# EAGLE design demeter_v28-TSSOP (EAGLE 6.1)
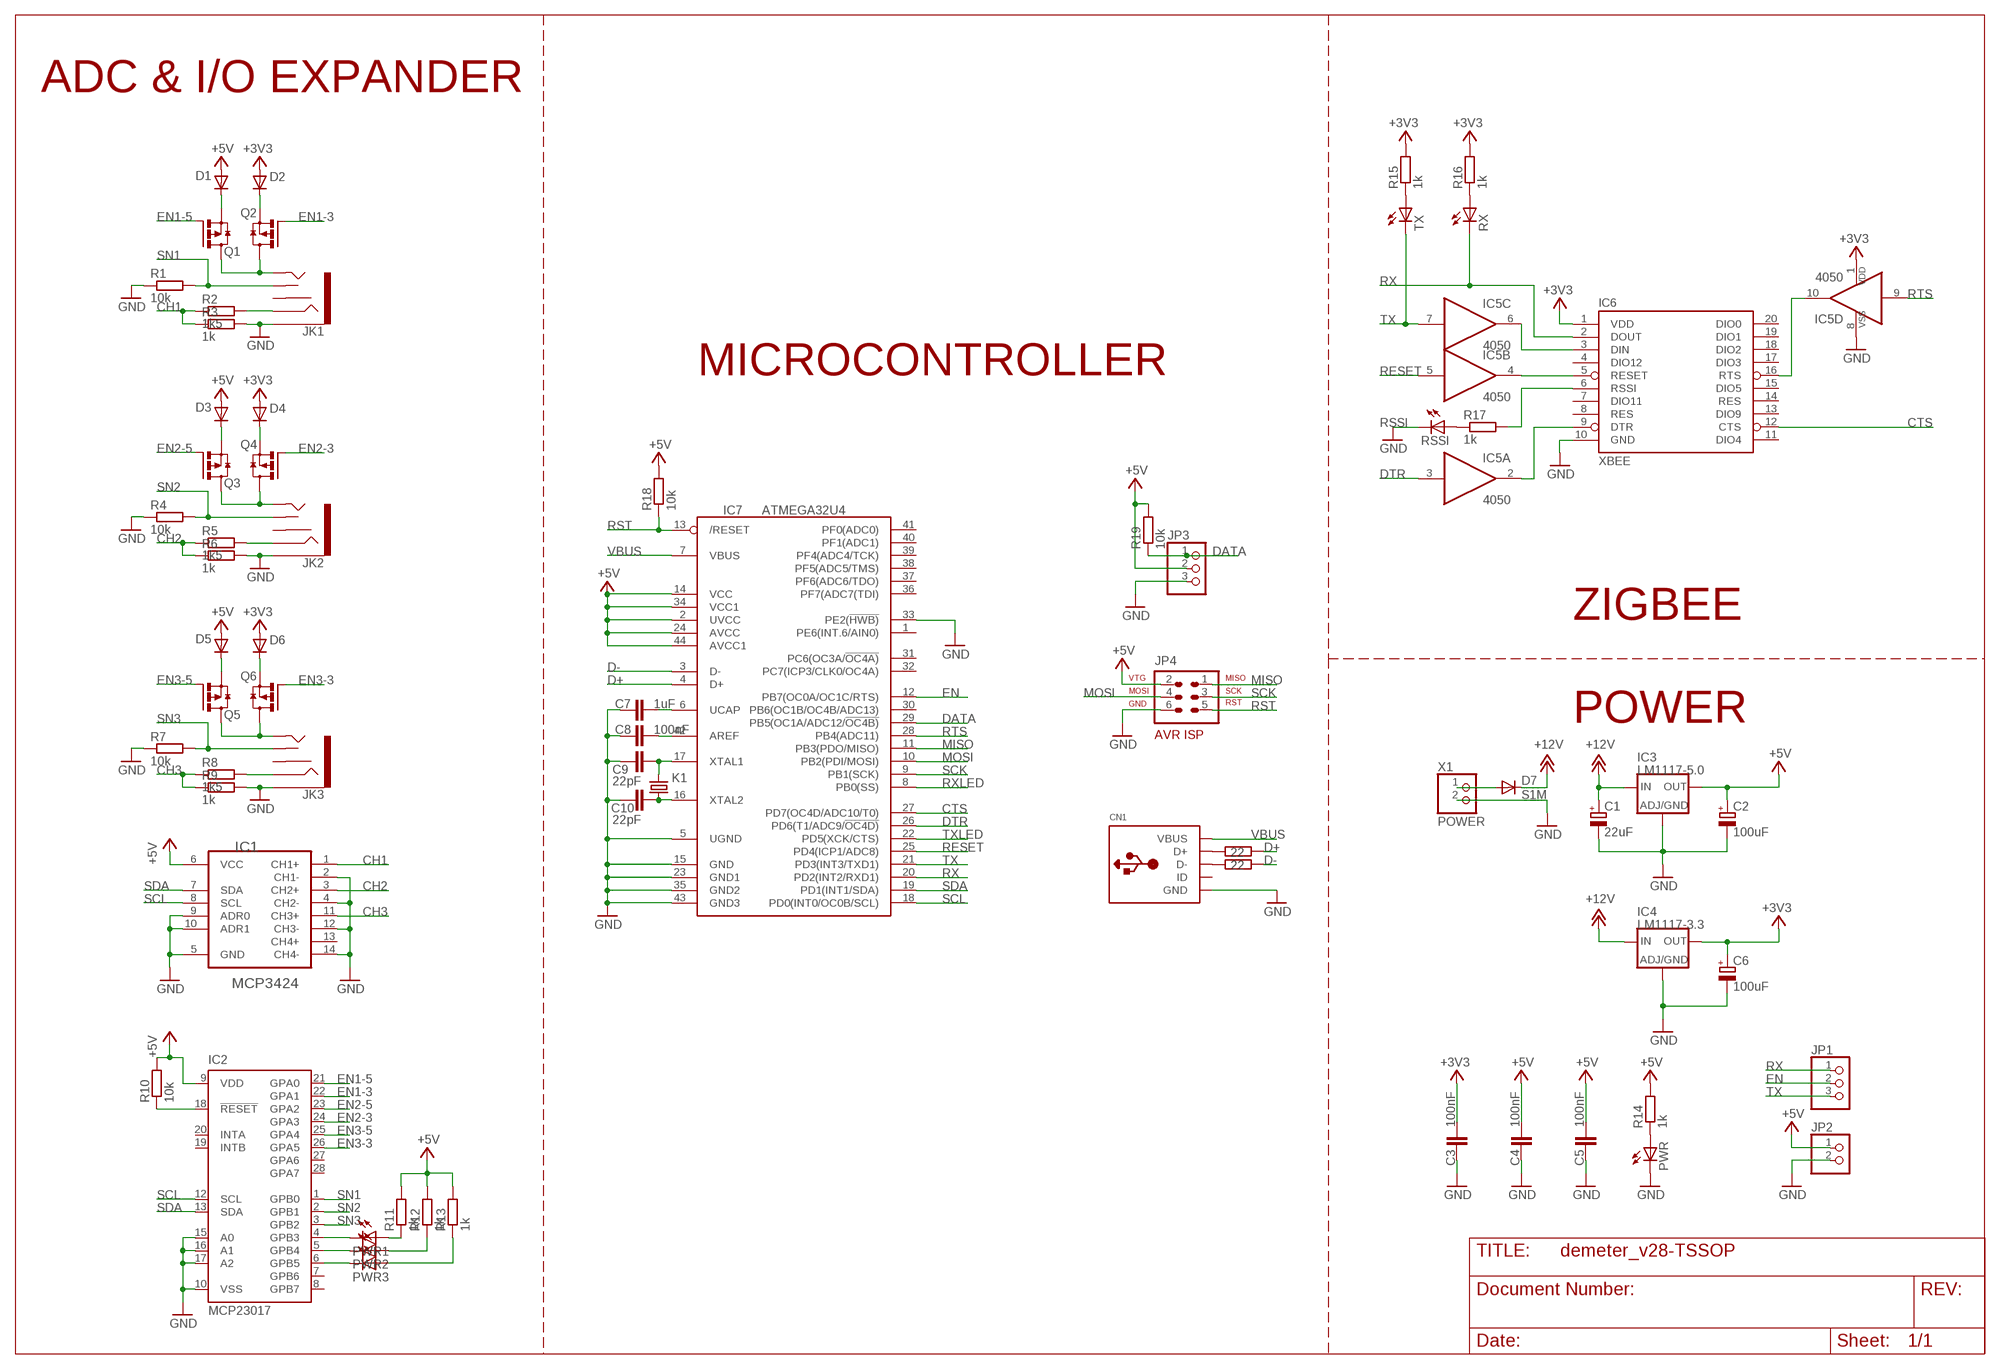
[diagram p0: schematic, sheet 1]

## Parts
C1  22uF  CPOL-EUPD  [PANASONIC_D]
C2  100uF  CPOL-EUPD  [PANASONIC_D]
C3  100nF  C-EUC0805K  [C0805K]
C4  100nF  C-EUC0805K  [C0805K]
C5  100nF  C-EUC0805K  [C0805K]
C6  100uF  CPOL-EUPD  [PANASONIC_D]
C7  1uF  C-EUC0805K  [C0805K]
C8  100nF  C-EUC0805K  [C0805K]
C9  22pF  C-EUC0805K  [C0805K]
C10  22pF  C-EUC0805K  [C0805K]
CN1  USBMINIB  [USB-MINIB]
D1  MBR0520  [SOD123]
D2  MBR0520  [SOD123]
D3  MBR0520  [SOD123]
D4  MBR0520  [SOD123]
D5  MBR0520  [SOD123]
D6  MBR0520  [SOD123]
D7  S1M  [DO-214AC]
IC1  MCP3424  MCP3424T  [TSSOP14]
IC2  MCP23017  MCP23017SO  [SO28W]
IC3  LM1117-5.0  LM1117DT  [DPACK]
IC4  LM1117-3.3  LM1117DT  [DPACK]
IC5  4050  4050D  [SO16]
IC6  XBEE  XBEE-1B1  [XBEE-1]
IC7  ATMEGA32U4  ATMEGA32U4-AU  [TQFP44]
JK1  AUDIO-JACK2PTH  [AUDIO-JACK]
JK2  AUDIO-JACK2PTH  [AUDIO-JACK]
JK3  AUDIO-JACK2PTH  [AUDIO-JACK]
JP1  PINHD-1X3180  [1X03]
JP2  PINHD-1X2  [1X02]
JP3  PINHD-1X3180  [1X03]
JP4  AVR-ISP  AVR-ISP-6  [AVR-ISP-6]
K1  CRYSTALHC49UP  [HC49UP]
PWR  LED0805  [CHIP-LED0805]
PWR1  LED0805  [CHIP-LED0805]
PWR2  LED0805  [CHIP-LED0805]
PWR3  LED0805  [CHIP-LED0805]
Q1  IRLML6402  [SOT23]
Q2  IRLML6402  [SOT23]
Q3  IRLML6402  [SOT23]
Q4  IRLML6402  [SOT23]
Q5  IRLML6402  [SOT23]
Q6  IRLML6402  [SOT23]
R1  10k  R-EU_R0805  [R0805]
R2  1k5  R-EU_R0805  [R0805]
R3  1k  R-EU_R0805  [R0805]
R4  10k  R-EU_R0805  [R0805]
R5  1k5  R-EU_R0805  [R0805]
R6  1k  R-EU_R0805  [R0805]
R7  10k  R-EU_R0805  [R0805]
R8  1k5  R-EU_R0805  [R0805]
R9  1k  R-EU_R0805  [R0805]
R10  10k  R-EU_R0805  [R0805]
R11  1k  R-EU_R0805  [R0805]
R12  1k  R-EU_R0805  [R0805]
R13  1k  R-EU_R0805  [R0805]
R14  1k  R-EU_R0805  [R0805]
R15  1k  R-EU_R0805  [R0805]
R16  1k  R-EU_R0805  [R0805]
R17  1k  R-EU_R0805  [R0805]
R18  10k  R-EU_R0805  [R0805]
R19  10k  R-EU_R0805  [R0805]
R20  22  R-EU_R0805  [R0805]
R21  22  R-EU_R0805  [R0805]
RSSI  LED0805  [CHIP-LED0805]
RX  LED0805  [CHIP-LED0805]
TX  LED0805  [CHIP-LED0805]
X1  POWER  W237-102  [W237-102]

## Nets
+3V3: C3.1 C6.+ D2.A D4.A D6.A IC4.4(OUT) IC5.1(P:VDD) IC6.1(VDD) R15.2 R16.2
+5V: C2.+ C4.1 C5.1 D1.A D3.A D5.A IC1.6(VCC) IC2.9(VDD) IC3.4(OUT) IC7.2(UVCC) IC7.14(VCC) IC7.24(AVCC) IC7.34(VCC1) IC7.44(AVCC1) JP2.1 JP3.2 JP4.2(VTG) R10.2 R11.2 R12.2 R13.2 R14.2 R18.2 R19.2
+12V: C1.+ D7.C IC3.3(IN) IC4.3(IN)
CH1: IC1.1(CH1+) R2.1 R3.1
CH2: IC1.3(CH2+) R5.1 R6.1
CH3: IC1.11(CH3+) R8.1 R9.1
CTS: IC6.12(CTS) IC7.27(PD7(OC4D/ADC10/T0))
D+: IC7.4(D+) R20.1
D-: IC7.3(D-) R21.1
DATA: IC7.29(PB5(OC1A/ADC12/!OC4B)) JP3.1 R19.1
DTR: IC5.3(A:I) IC7.26(PD6(T1/ADC9/!OC4D))
EN: IC7.12(PB7(OC0A/OC1C/RTS)) JP1.2
EN1-3: IC2.22(GPA1) Q2.1(G)
EN1-5: IC2.21(GPA0) Q1.1(G)
EN2-3: IC2.24(GPA3) Q4.1(G)
EN2-5: IC2.23(GPA2) Q3.1(G)
EN3-3: IC2.26(GPA5) Q6.1(G)
EN3-5: IC2.25(GPA4) Q5.1(G)
GND: C1.- C2.- C3.2 C4.2 C5.2 C6.- C7.2 C8.2 C9.2 C10.2 CN1.GND CN1.GND1(GND) CN1.GND2(GND) CN1.GND3(GND) CN1.GND4(GND) IC1.2(CH1-) IC1.4(CH2-) IC1.5(GND) IC1.9(ADR0) IC1.10(ADR1) IC1.12(CH3-) IC1.14(CH4-) IC2.10(VSS) IC2.15(A0) IC2.16(A1) IC2.17(A2) IC3.1(ADJ) IC4.1(ADJ) IC5.8(P:VSS) IC6.10(GND) IC7.5(UGND) IC7.15(GND) IC7.23(GND1) IC7.33(PE2(!HWB)) IC7.35(GND2) IC7.43(GND3) JK1.SLEEVE JK2.SLEEVE JK3.SLEEVE JP2.2 JP3.3 JP4.6(GND) PWR.C R1.1 R3.2 R4.1 R6.2 R7.1 R9.2 RSSI.C X1.2
MISO: IC7.11(PB3(PDO/MISO)) JP4.1(MISO)
MOSI: IC7.10(PB2(PDI/MOSI)) JP4.4(MOSI)
N$1: D7.A X1.1
N$2: PWR.A R14.1
N$3: IC5.6(C:O) IC6.3(DIN)
N$4: IC5.4(B:O) IC6.5(RESET)
N$5: PWR3.A R13.1
N$6: R17.1 RSSI.A
N$7: IC5.2(A:O) IC6.9(DTR)
N$8: IC5.10(D:O) IC6.16(RTS)
N$9: IC2.6(GPB5) PWR3.C
N$10: IC2.4(GPB3) PWR1.C
N$11: IC2.18(!RESET) R10.1
N$12: JK1.TIP Q1.3(D) Q2.3(D)
N$13: D1.C Q1.2(S)
N$14: D2.C Q2.2(S)
N$15: JK2.TIP Q3.3(D) Q4.3(D)
N$16: D3.C Q3.2(S)
N$17: D4.C Q4.2(S)
N$18: JK3.TIP Q5.3(D) Q6.3(D)
N$19: D5.C Q5.2(S)
N$20: D6.C Q6.2(S)
N$22: PWR2.A R12.1
N$23: PWR1.A R11.1
N$24: C7.1 IC7.6(UCAP)
N$25: C8.1 IC7.42(AREF)
N$26: C9.1 IC7.17(XTAL1) K1.2
N$27: C10.1 IC7.16(XTAL2) K1.1
N$28: CN1.D+ R20.2
N$29: CN1.D- R21.2
N$30: JK1.RING R2.2
N$32: JK2.RING R5.2
N$33: IC2.5(GPB4) PWR2.C
N$34: JK3.RING R8.2
N$36: R15.1 TX.A
N$37: R16.1 RX.A
RESET: IC5.5(B:I) IC7.25(PD4(ICP1/ADC8))
RSSI: IC6.6(RSSI) R17.2
RST: IC7.13(/RESET) JP4.5(RST) R18.1
RTS: IC5.9(D:I) IC7.28(PB4(ADC11))
RX: IC6.2(DOUT) IC7.20(PD2(INT2/RXD1)) JP1.1 RX.C
RXLED: IC7.8(PB0(SS))
SCK: IC7.9(PB1(SCK)) JP4.3(SCK)
SCL: IC1.8(SCL) IC2.12(SCL) IC7.18(PD0(INT0/OC0B/SCL))
SDA: IC1.7(SDA) IC2.13(SDA) IC7.19(PD1(INT1/SDA))
SN1: IC2.1(GPB0) JK1.TSH R1.2
SN2: IC2.2(GPB1) JK2.TSH R4.2
SN3: IC2.3(GPB2) JK3.TSH R7.2
TX: IC5.7(C:I) IC7.21(PD3(INT3/TXD1)) JP1.3 TX.C
TXLED: IC7.22(PD5(XCK/CTS))
VBUS: CN1.VBUS IC7.7(VBUS)
Unconnected: CN1.ID IC1.13(CH4+) IC2.7(GPB6) IC2.8(GPB7) IC2.19(INTB) IC2.20(INTA) IC2.27(GPA6) IC2.28(GPA7) IC5.11(E:I) IC5.12(E:O) IC5.14(F:I) IC5.15(F:O) IC6.4(DIO12) IC6.7(DIO11) IC6.8(RES) IC6.11(DIO4) IC6.13(DIO9) IC6.14(RES) IC6.15(DIO5) IC6.17(DIO3) IC6.18(DIO2) IC6.19(DIO1) IC6.20(DIO0) IC7.1(PE6(INT.6/AIN0)) IC7.30(PB6(OC1B/OC4B/ADC13)) IC7.31(PC6(OC3A/!OC4A)) IC7.32(PC7(ICP3/CLK0/OC4A)) IC7.36(PF7(ADC7(TDI)) IC7.37(PF6(ADC6/TDO)) IC7.38(PF5(ADC5/TMS)) IC7.39(PF4(ADC4/TCK)) IC7.40(PF1(ADC1)) IC7.41(PF0(ADC0)) JK1.RSH JK2.RSH JK3.RSH

## Notes on the sheet
- ADC & I/O EXPANDER
- MICROCONTROLLER
- ZIGBEE
- POWER

## Library data of the parts
C1 C2 C6 = mark_2:CPOL-EU: POLARIZED CAPACITOR, European symbol
C3-C5 C7-C10 = mark_2:C-EU: CAPACITOR, European symbol
CN1 = mark_2:USB: USB Connectors USBMINIB - Surface Mount Female Mini-B USB Connector 4UConnector: 06564 By microbuilder.eu Thru-hole RA Female Mini-B USB Connector 4UConnector: 18732 By ladyada.net
D1-D6 = mark_2:MBR0520: SCHOTTKY BARRIER RECTIFIER Source: http://onsemi.com .. MBR0520LT1-D.pdf
D7 = mark_2:S1M
IC1 = mark_2:MCP3424: Analog-to-Digital Converter
IC2 = mark_2:MCP23017: http://ww1.microchip.com/downloads/en/DeviceDoc/21952a.pdf Source: http://ww1.microchip.com/downloads/en/DeviceDoc/21952a.pdf; MF: MICROCHIP; MPN: MCP23017-E/SO; OC_FARNELL: 1332087; OC_NEWARK: 31K2958
IC3 IC4 = mark_2:LM1117: Low drop fixed and adjustable positive voltage regulators 1 A Source: http://www.st.com/stonline/products/literature/ds/7194/ld1117axx.pdf
IC5 = mark_2:4050: Hex non-inverting BUFFER
IC6 = mark_2:XBEE-1
IC7 = mark_2:ATMEGA32U4: http://www.ladyada.net/library/eagle
JK1-JK3 = mark_2:AUDIO-JACK2
JP1 JP3 = mark_2:PINHD-1X3: PIN HEADER
JP2 = mark_2:PINHD-1X2: PIN HEADER
JP4 = mark_2:AVR-ISP-6: AVR ISP-6 Serial Programming Header
K1 = mark_2:CRYSTAL: CRYSTAL
PWR PWR1-PWR3 RSSI RX TX = mark_2:LED
Q1-Q6 = mark_2:IRLML6402: Single P-Channe MOSFET
R1-R21 = mark_2:R-EU_: RESISTOR, European symbol
X1 = mark_2:W237-102: WAGO SCREW CLAMP

## Board
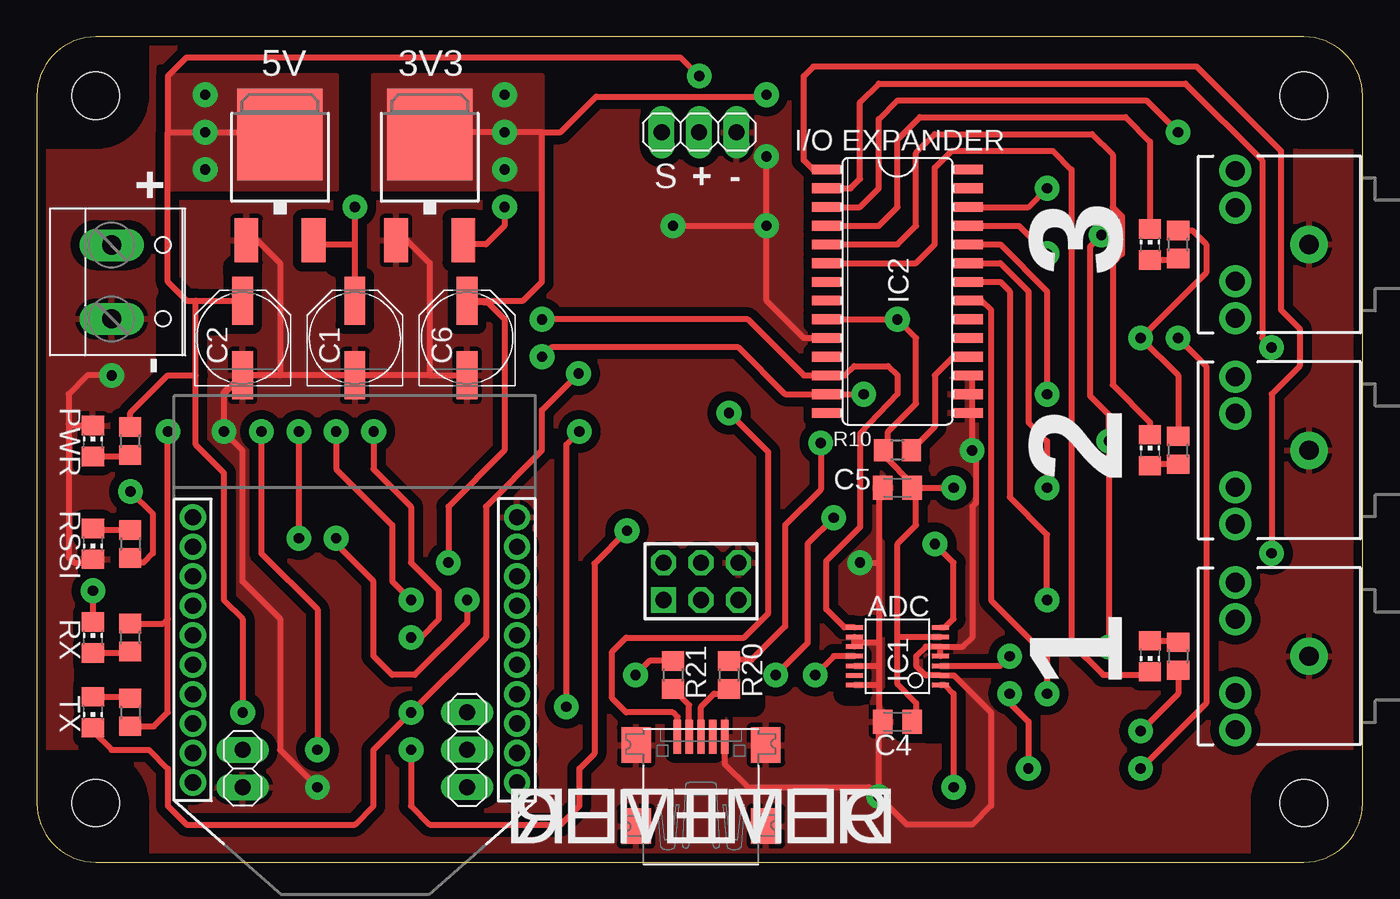
[diagram p1: board, top side]
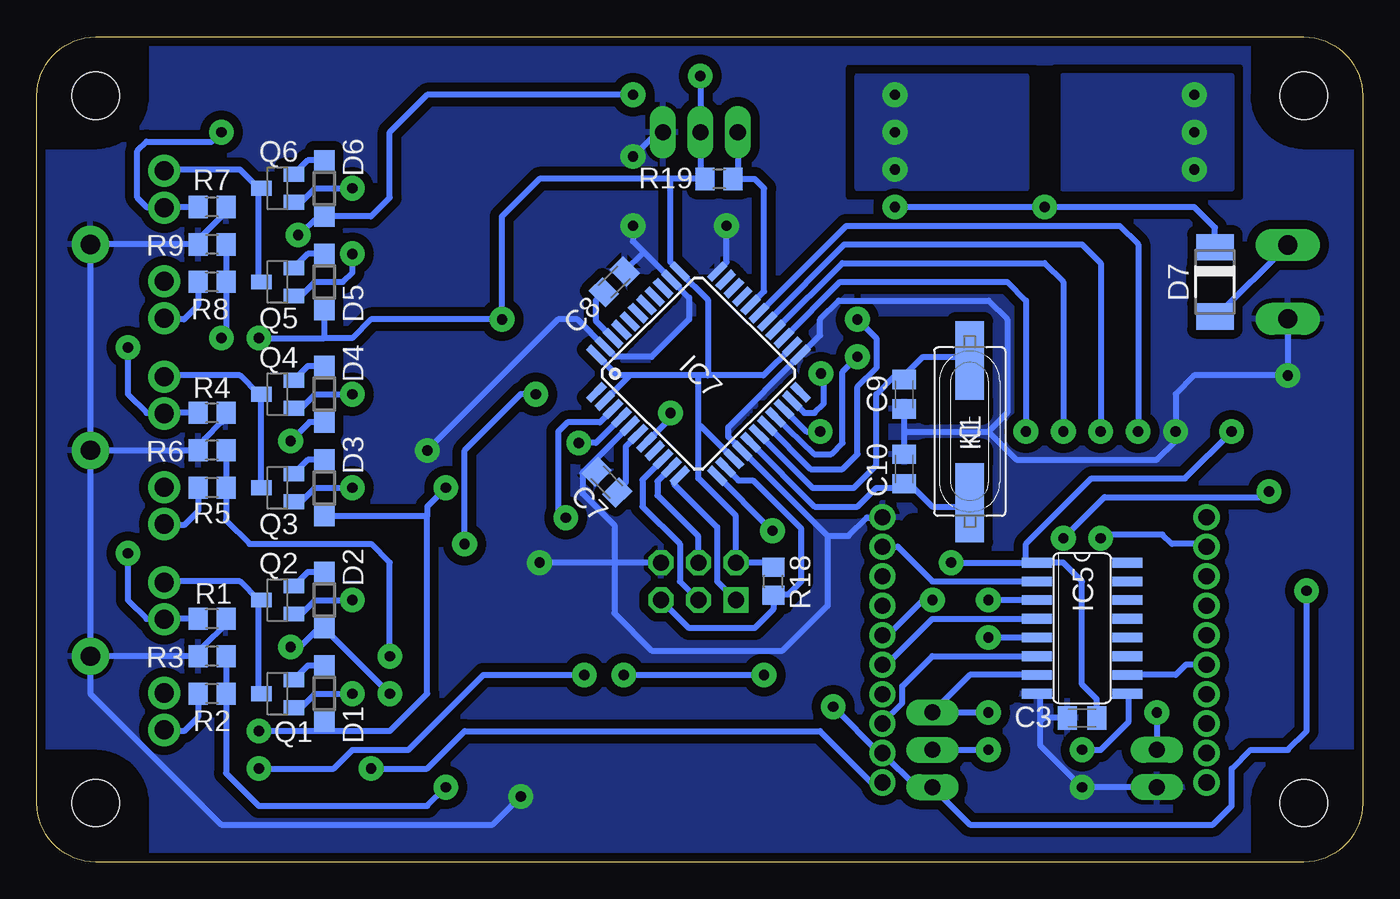
[diagram p2: board, bottom side, seen from below]

Size 90 x 56 mm. Coordinates in mm from the lower left corner, seen from the top.
Copper layers (1*16): Top 0.035mm / dielectric 1.5mm / Bottom 0.035mm
Design rules: minimum track width 12mil, minimum drill 20mil, track to track 8mil, track to pad 8mil, pad to pad 8mil, via to via 8mil, smd to smd 8mil, copper to edge 10mil, drill to drill 8mil, minimum pad ring 12mil, minimum via ring 10mil, stop-mask expansion 4mil, vias tented up to drill 25mil, thermal gap 12mil
tRestrict: area 55.2,34.3 to 58.8,36.2; area 58,22.5 to 59.1,24.1; area 60.3,8.9 to 61.6,11.4; area 46.4,10.7 to 48.6,12.7; area 3.3,12.1 to 6.9,13.3; area 8.9,33.7 to 9.5,38.1; area 20.3,40.5 to 21,41.3; area 13.5,40 to 14.5,40.4; area 11.4,36.6 to 12.7,37.5; area 56.5,15.7 to 56.6,16; area 54.9,11.4 to 55.9,11.6; area 58.2,10.9 to 58.5,11.3; area 59.2,12.1 to 59.8,12.6; area 59.2,14.2 to 59.6,14.6
bRestrict: area 19.8,11.9 to 20.7,13.1; area 10.7,38.7 to 11.2,40.3; area 21.2,53 to 22,53.2; area 41.5,29.8 to 43.8,32.1; area 45.3,34 to 47.5,36.2; area 28.7,26 to 29.7,26.8; area 28.3,31.5 to 29.6,31.9; area 28.6,22.2 to 30.5,22.9; area 28.6,35.6 to 32.4,36.2; area 24.1,11.4 to 24.8,12.1; area 11.4,3.2 to 12.1,3.8; area 75.6,15.2 to 76.2,16.5; area 76.2,17.8 to 78.1,18.4; area 75.6,29.2 to 76.2,30.5; area 76.2,31.8 to 78.1,32.4; area 75.6,43.8 to 76.2,44.5; area 76.8,45.7 to 78.1,46.4; area 25.9,27.3 to 29.7,27.9; area 25.9,30.5 to 29.6,31.1

### Footprints (pad centres in the part's own frame; a part is rotated, then mirrored left to right if it is on the bottom)
PANASONIC_D = smd 3.254 x 1.4: + 2.527,0; - -2.527,0
C0805K = smd 1.3 x 1.6: 1 -1,0; 2 1,0
USB-MINIB = smd 0.5 x 2.308: D+ 0,4.064; D- -0.8,4.064; GND 1.6,4.064; ID 0.8,4.064; VBUS -1.6,4.064 | smd 2 x 2.4: GND1 -4.4,-2; GND2 -4.4,3.5; GND3 4.4,3.5; GND4 4.4,-2
SOD123 = smd 1.4 x 1.4: A 1.9,0; C -1.9,0
DO-214AC = smd 1.778 x 2.54: A 2.342,0; C -2.342,0
TSSOP14 = smd 0.305 x 1.143: 1 -1.95,-2.918; 2 -1.3,-2.918; 3 -0.65,-2.918; 4 0,-2.918; 5 0.65,-2.918; 6 1.3,-2.918; 7 1.95,-2.918; 8 1.95,2.918; 9 1.3,2.918; 10 0.65,2.918; 11 0,2.918; 12 -0.65,2.918; 13 -1.3,2.918; 14 -1.95,2.918
SO28W = smd 0.66 x 2.032: 1 -7.62,-4.78; 2 -6.35,-4.78; 3 -5.08,-4.78; 4 -3.81,-4.78; 5 -2.54,-4.78; 6 -1.27,-4.78; 7 0,-4.78; 8 1.27,-4.78; 9 2.54,-4.78; 10 3.81,-4.78; 11 5.08,-4.78; 12 6.35,-4.78; 13 7.62,-4.78; 14 8.89,-4.78; 15 8.89,4.78; 16 7.62,4.78; 17 6.35,4.78; 18 5.08,4.78; 19 3.81,4.78; 20 2.54,4.78; 21 1.27,4.78; 22 0,4.78; 23 -1.27,4.78; 24 -2.54,4.78; 25 -3.81,4.78; 26 -5.08,4.78; 27 -6.35,4.78; 28 -7.62,4.78
DPACK = smd 1.6 x 3: 1 -2.28,-4.8; 3 2.28,-4.8 | smd 5.8 x 6.2: 4 0,2.38
SO16 = smd 0.66 x 2.032: 1 -4.445,-3.073; 2 -3.175,-3.073; 3 -1.905,-3.073; 4 -0.635,-3.073; 5 0.635,-3.073; 6 1.905,-3.073; 7 3.175,-3.073; 8 4.445,-3.073; 9 4.445,3.073; 10 3.175,3.073; 11 1.905,3.073; 12 0.635,3.073; 13 -0.635,3.073; 14 -1.905,3.073; 15 -3.175,3.073; 16 -4.445,3.073
XBEE-1 = drill 1.1 pad 1.778: 1 -11,20; 2 -11,18; 3 -11,16; 4 -11,14; 5 -11,12; 6 -11,10; 7 -11,8; 8 -11,6; 9 -11,4; 10 -11,2; 11 11,2; 12 11,4; 13 11,6; 14 11,8; 15 11,10; 16 11,12; 17 11,14; 18 11,16; 19 11,18; 20 11,20
TQFP44 = smd 1.5 x 0.5: 1 -5.8,4; 2 -5.8,3.2; 3 -5.8,2.4; 4 -5.8,1.6; 5 -5.8,0.8; 6 -5.8,0; 7 -5.8,-0.8; 8 -5.8,-1.6; 9 -5.8,-2.4; 10 -5.8,-3.2; 11 -5.8,-4; 23 5.8,-4; 24 5.8,-3.2; 25 5.8,-2.4; 26 5.8,-1.6; 27 5.8,-0.8; 28 5.8,0; 29 5.8,0.8; 30 5.8,1.6; 31 5.8,2.4; 32 5.8,3.2; 33 5.8,4 | smd 0.5 x 1.5: 12 -4,-5.8; 13 -3.2,-5.8; 14 -2.4,-5.8; 15 -1.6,-5.8; 16 -0.8,-5.8; 17 0,-5.8; 18 0.8,-5.8; 19 1.6,-5.8; 20 2.4,-5.8; 21 3.2,-5.8; 22 4,-5.8; 34 4,5.8; 35 3.2,5.8; 36 2.4,5.8; 37 1.6,5.8; 38 0.8,5.8; 39 0,5.8; 40 -0.8,5.8; 41 -1.6,5.8; 42 -2.4,5.8; 43 -3.2,5.8; 44 -4,5.8
AUDIO-JACK = drill 1.3 pad 2.184: RING 5,5; RSH 5,2.5; TIP 5,-5; TSH 5,-2.5 | drill 1.3 pad 2.54: SLEEVE 0,0
1X03 = drill 1.1 pad 1.778 long: 1 -2.54,0; 2 0,0; 3 2.54,0
1X02 = drill 1.1 pad 1.778 long: 1 -1.27,0; 2 1.27,0
AVR-ISP-6 = drill 1.1 square: 1 -2.54,-1.27 | drill 1.1 octagon: 2 -2.54,1.27; 3 0,-1.27; 4 0,1.27; 5 2.54,-1.27; 6 2.54,1.27
HC49UP = smd 5.334 x 1.93: 1 -4.826,0; 2 4.826,0
CHIP-LED0805 = smd 1.5 x 1.3: A 0,-1.05; C 0,1.05
SOT23 = smd 1 x 1.4: 1 -0.95,-1.1; 2 0.95,-1.1; 3 0,1.1
R0805 = smd 1.3 x 1.5: 1 -0.95,0; 2 0.95,0
DP9056_V1 = hole 3.2: 4,4; 86,4; 86,52; 4,52
W237-102 = drill 1.3 pad 2.184 long: 1 -2.5,-1.27; 2 2.5,-1.27

### Placement (x,y rotation side)
C1  21.59,35.56 90 top
C2  13.97,35.56 90 top
C3  19.05,9.78 180 bottom
C4  58.42,9.53 180 top
C5  58.42,25.4 180 top
C6  29.21,35.56 90 top
C7  51.31,25.78 135 bottom
C8  50.8,39.37 45 bottom
C9  31.11,31.75 270 bottom
C10  31.11,26.67 90 bottom
CN1  45.09,4.45 0 top
D1  70.48,11.43 270 bottom
D2  70.48,17.78 270 bottom
D3  70.48,25.4 270 bottom
D4  70.48,31.75 270 bottom
D5  70.48,39.37 270 bottom
D6  70.48,45.72 270 bottom
D7  10.03,39.37 270 bottom
IC1  58.42,13.97 90 top
IC2  58.42,39.37 270 top
IC3  16.51,46.99 0 top
IC4  26.67,46.99 0 top
IC5  19.05,15.88 270 bottom
IC6  21.59,25.4 180 top
IC7  45.09,33.15 45 bottom
JK1  86.36,13.97 180 top
JK2  86.36,27.94 180 top
JK3  86.36,41.91 180 top
JP1  29.21,7.62 90 top
JP2  13.97,6.35 270 top
JP3  44.96,49.53 0 top
JP4  45.09,19.05 0 top
K1  26.67,29.21 90 bottom
PWR  3.81,28.57 0 top
PWR1  75.56,41.91 0 top
PWR2  75.56,27.94 0 top
PWR3  75.56,13.97 180 top
Q1  73.66,11.43 90 bottom
Q2  73.66,17.78 90 bottom
Q3  73.66,25.4 90 bottom
Q4  73.66,31.75 90 bottom
Q5  73.66,39.37 90 bottom
Q6  73.66,45.72 90 bottom
R1  78.11,16.51 180 bottom
R2  78.11,11.43 180 bottom
R3  78.11,13.97 180 bottom
R4  78.11,30.48 180 bottom
R5  78.11,25.4 180 bottom
R6  78.11,27.94 180 bottom
R7  78.11,44.45 180 bottom
R8  78.11,39.37 180 bottom
R9  78.11,41.91 180 bottom
R10  58.42,27.94 180 top
R11  77.47,41.91 90 top
R12  77.47,27.94 90 top
R13  77.47,13.97 270 top
R14  6.35,28.57 90 top
R15  6.35,10.16 270 top
R16  6.35,15.24 90 top
R17  6.35,21.59 270 top
R18  40.01,19.05 90 bottom
R19  43.69,46.35 180 bottom
R20  46.99,12.7 270 top
R21  43.18,12.7 270 top
RSSI  3.81,21.59 180 top
RX  3.81,15.24 0 top
TX  3.81,10.16 180 top
U$6  [DP9056_V1]  0,0 0 top
X1  6.35,39.37 270 top

### Tracks (layer width: path | path; a pad name or v marks a point on that pad's centre or on a via)
+3V3  (via drill 0.7 pad 1.68)
  Top 0.406: v72.77,14.61 v72.77,28.57 72.77,30.35 71.5,31.62 71.5,41.78 v72.26,42.55 | C6.+ 30.62,37.96 31.75,36.83 31.75,27.94 27.94,24.13 v27.94,20.32 | R15.2 7.94,9.21 8.89,10.16 8.89,16.51 | R16.2 8.57,16.19 8.89,16.51 | 29.21,39.05 C6.+ | C6.+ 33.02,38.1 34.29,39.37 34.29,49.53 | 34.29,49.53 35.56,49.53 37.97,51.94 48.9,51.94 49.15,51.94 49.4,51.94 v49.53,52.07 | 8.89,16.51 v8.89,29.21 | 34.29,49.53 26.83,49.53 IC4.4 | v66.04,11.43 66.04,10.79 67.31,9.53 v67.31,6.35
  Bottom 0.406: D6.A 67.31,43.81 66.04,45.09 66.04,49.53 63.5,52.07 v49.53,52.07 | v72.77,14.61 72.14,14.61 70.86,15.88 D2.A v66.04,11.44 v66.04,11.43 | v67.31,6.35 63.5,6.35 60.96,8.89 36.83,8.89 33.34,5.4 IC6.1 | D6.A | 22.86,20.32 IC5.1 21.97,20.32 | v27.94,20.32 22.86,20.32 | 21.97,20.32 22.1,20.45 22.73,20.45 22.86,20.32 | D4.A 71.5,29.85 v72.77,28.57 | v8.89,29.21 12.06,26.04 18.41,26.04 22.86,21.59 22.86,20.32 | C3.1 18.05,11.06 19.05,12.06 19.05,19.05 20.32,20.32 21.97,20.32 | D6.A 70.86,43.82 v72.26,42.55
  other vias: 31.75,52.07 31.75,49.53 31.75,46.99
  pour Top (isolate 0.406, no thermals): 22.86,53.34 22.86,45.72 34.29,45.72 34.29,53.34
  pour Bottom (isolate 0.406, no thermals): 22.86,53.34 22.86,45.72 34.29,45.72 34.29,53.34
+5V  (via drill 0.7 pad 1.68)
  Top 0.406: 57.78,27.94 R10.2 | 59.37,9.53 C4.1 59.69,9.79 59.69,10.79 58.42,12.06 58.42,15.24 | C5.1 59.37,25.4 59.37,25.72 57.66,27.43 57.66,27.75 R10.2 | R10.2 | 58.42,15.24 58.42,21.59 59.69,22.86 59.69,25.13 C5.1 | C5.1 59.37,25.35 59.64,25.35 59.69,25.4 v62.23,25.4 | R10.2 57.78,28.25 57.78,29.21 59.69,31.11 59.69,35.56 v58.42,36.83 IC2.9 | R13.2 77.47,11.43 v74.93,8.89 | R12.2 77.47,33.02 v74.93,35.56 79.38,40.01 79.38,41.91 78.42,42.86 R11.2 | 8.89,49.53 v11.43,49.53 16.35,49.53 IC3.4 | 8.89,49.53 8.89,39.37 10.16,38.1 10.79,38.1 | C2.+ 13.83,38.1 10.79,38.1 | 8.89,49.53 8.89,53.34 10.16,54.61 43.69,54.61 v44.96,53.34 | v13.97,10.16 13.97,16.51 12.7,17.78 12.7,26.42 10.79,28.32 10.79,33.02 | R14.2 6.35,30.48 8.89,33.02 10.79,33.02 | IC1.6 58.45,15.27 58.42,15.24 | 10.79,33.02 10.79,38.1
  Bottom 0.406: D5.A 70.48,35.56 | v74.93,35.56 70.48,35.56 | D3.A 63.51,23.5 63.5,23.5 | D1.A 70.48,8.89 | 70.48,8.89 v74.93,8.89 | 70.48,8.89 66.04,8.89 63.5,11.43 63.5,23.5 | 44.45,46.35 R19.2 | R18.2 40.32,20.32 JP4.2 42.55,23.5 45.09,26.04 45.09,29.59 | 45.09,33.02 49.74,33.02 | 49.74,33.02 50.62,33.02 IC7.44 | IC7.2 49.74,33.02 | 44.45,33.02 40.69,33.02 IC7.24 | 44.45,33.02 44.45,38.17 IC7.34 46.99,40.71 46.99,46.35 | R19.2 44.96,46.55 JP3.2 v44.96,53.34 | R19.2 44.83,46.35 44.96,46.48 45.09,46.35 46.99,46.35 | 46.99,46.35 55.88,46.35 58.42,43.81 v58.42,36.83 67.31,36.83 68.58,35.56 70.48,35.56 | v62.23,25.4 63.5,24.13 63.5,23.5 | 45.09,29.59 45.09,33.02 | 45.09,29.59 44.92,29.59 IC7.14 | 44.45,33.02 45.09,33.02 | v13.97,10.16 JP2.1
  other vias: 11.43,52.07 11.43,46.99
  pour Bottom (isolate 0.406, no thermals): 8.89,53.34 20.32,53.34 20.32,45.72 8.89,45.72
  pour Top (isolate 0.406, no thermals): 8.89,53.34 8.89,45.72 20.32,45.72 20.32,53.34
+12V  (via drill 0.7 pad 1.68)
  Top 0.406: C1.+ 21.59,39.37 21.59,41.91 | 28.89,42.23 IC4.3 29.23,41.91 30.48,41.91 31.75,43.18 v31.75,44.45 | 21.59,41.91 19.07,41.91 IC3.3 | 21.59,41.91 v21.59,44.45
  Bottom 0.406: v31.75,44.45 v21.59,44.45 11.43,44.45 10.03,43.05 D7.C
CH1  (via drill 0.7 pad 1.68)
  Top 0.406: v62.23,5.08 62.23,11.43 61.64,12.02 IC1.1
  Bottom 0.406: R3.1 R2.1 77.15,6.03 74.93,3.81 63.5,3.81 v62.23,5.08
CH2  (via drill 0.7 pad 1.68)
  Top 0.406: v66.04,13.97 65.39,13.32 IC1.3
  Bottom 0.406: R6.1 R5.1 | R5.1 | R5.1 77.16,23.18 75.56,21.59 67.31,21.59 66.04,20.32 v66.04,13.97
CH3  (via drill 0.7 pad 1.68)
  Top 0.406: v77.47,35.56 79.38,33.66 79.38,10.79 v74.93,6.35 | v52.83,12.7 54.1,13.97 IC1.11
  Bottom 0.406: R9.1 R8.1 77.16,35.88 v77.47,35.56 | v74.93,6.35 69.85,6.35 68.58,7.62 64.77,7.62 59.69,12.7 v52.83,12.7
CTS  (via drill 0.7 pad 1.68)
  Top 0.406: v17.78,29.21 v17.78,21.97
  Bottom 0.406: v17.78,29.21 17.78,40.64 19.05,41.91 35.19,41.91 IC7.27 | v17.78,21.97 17.53,22.23 13.59,22.23 12.95,21.59 10.78,21.59 IC6.12
D+  (via drill 0.7 pad 1.68)
  Top 0.406: R20.1 47.06,13.72 48.51,13.72 50.8,16 50.8,22.86 53.21,25.27 v53.21,28.45
  Bottom 0.406: IC7.4 52.05,28.45 v53.21,28.45
D-  (via drill 0.7 pad 1.68)
  Top 0.406: 43.18,13.97 R21.1 41.59,13.65 v40.64,12.7 | v54.1,23.37 52.32,21.59 52.32,14.86 v50.16,12.7
  Bottom 0.406: IC7.3 51.78,29.84 53.98,29.84 54.61,29.21 54.61,23.88 v54.1,23.37 | v50.16,12.7 v40.64,12.7
DATA
  Bottom 0.406: IC7.29 40.64,38.72 40.64,45.72 41.27,46.35 R19.1 42.42,46.8 JP3.1
DTR  (via drill 0.7 pad 1.68)
  Top 0.406: v20.32,29.21 20.32,26.67 24.13,22.86 24.13,19.05 v25.4,17.78
  Bottom 0.406: IC7.26 35.33,40.64 21.59,40.64 20.32,39.37 v20.32,29.21 | IC5.3 v25.4,17.78
EN  (via drill 0.7 pad 1.68)
  Top 0.406: v40.07,22.48 37.85,20.26 37.85,7.37 36.83,6.35 36.83,3.81 35.56,2.54 26.67,2.54 25.4,3.81 v25.4,7.62
  Bottom 0.406: IC7.12 40.33,22.73 v40.07,22.48 | JP1.2 v25.4,7.62
EN1-3  (via drill 0.7 pad 1.68)
  Top 0.406: v68.58,17.78 68.58,22.23 66.04,24.77 66.04,38.73 65.41,39.37 IC2.22
  Bottom 0.406: Q2.1 72.07,16.83 71.12,17.78 v68.58,17.78
EN1-5  (via drill 0.7 pad 1.68)
  Top 0.406: IC2.21 64.14,38.1 64.77,37.47 64.77,17.78 68.58,13.97 v68.58,11.43
  Bottom 0.406: Q1.1 72.07,10.48 71.12,11.43 v68.58,11.43
EN2-3  (via drill 0.7 pad 1.68)
  Top 0.406: v68.58,31.75 68.58,38.73 65.41,41.91 IC2.24
  Bottom 0.406: Q4.1 72.07,30.8 71.12,31.75 v68.58,31.75
EN2-5  (via drill 0.7 pad 1.68)
  Top 0.406: IC2.23 65.41,40.64 67.31,38.73 67.31,29.84 68.58,28.57 v68.58,25.4
  Bottom 0.406: v68.58,25.4 71.12,25.4 72.07,24.45 Q3.1
EN3-3  (via drill 0.7 pad 1.68)
  Top 0.406: IC2.26 67.31,44.45 v68.58,45.72
  Bottom 0.406: Q6.1 72.07,44.77 71.12,45.72 v68.58,45.72
EN3-5  (via drill 0.7 pad 1.68)
  Top 0.406: IC2.25 62.55,43.18 66.67,43.18 v68.58,41.27
  Bottom 0.406: Q5.1 72.07,38.42 71.12,39.37 69.22,39.37 68.58,40.01 v68.58,41.27
GND  (via drill 0.7 pad 1.68)
  Top 0.406: 63.18,33.02 IC2.17 63.5,32.72 63.5,31.45 | 63.18,30.48 IC2.15 63.5,30.18 | 57.15,9.53 C4.2 | 57.47,9.53 C4.2 | C5.2 57.15,25.13 57.15,25.15 57.4,24.89 57.15,24.64 57.15,20.32 | 63.5,30.18 v63.5,27.94 63.75,27.69 63.75,24.38 63.5,24.13 63.5,15.24 62.88,14.62 IC1.5 | 63.18,31.77 IC2.16 63.5,31.45 | v57.15,4.45 57.15,9.26 C4.2 | C4.2 57.15,9.79 57.15,12.06 | 57.15,14.92 57.15,13.34 | 57.15,13.34 57.15,12.06 | v57.15,4.45 59.05,2.54 63.5,2.54 64.77,3.81 64.77,10.16 62.26,12.67 IC1.2 60.35,12.67 59.69,13.34 59.69,13.97 60.34,14.62 IC1.5 | v57.15,4.45 56.52,5.08 48.26,5.08 46.69,6.66 CN1.GND | IC2.10 52.07,35.56 49.53,38.1 v49.53,43.18 | v43.18,43.18 v49.53,43.18 | v55.88,20.32 57.15,20.32 | v49.53,43.18 v49.53,47.88 | 63.5,30.18 63.5,31.45 | 3.81,20.64 RSSI.C 3.59,20.32 2.54,20.32 2.16,20.7 2.16,29.72 | 21.59,33.66 C1.- | 29.21,34.29 C6.- 29.07,33.02 26.67,33.02 | C2.- | IC3.1 14.23,42.92 16.51,40.64 16.51,33.02 | 14.11,33.02 C2.- | IC4.1 24.39,42.92 26.67,40.64 26.67,33.02 | 2.16,29.72 2.16,31.75 3.43,33.02 v5.08,33.02 | v19.05,5.08 16.51,7.62 16.51,16.51 13.97,19.05 13.97,27.94 v12.7,29.21 12.7,31.75 | 26.67,33.02 21.73,33.02 | 21.73,33.02 C1.- | C1.- | C1.- 16.51,33.02 | 16.51,33.02 14.11,33.02 | 14.11,33.02 C2.- | 12.7,31.75 12.7,31.89 C2.- | 21.73,33.02 C1.- | C2.- 12.7,31.75 | PWR.C 2.25,29.62 2.16,29.72 | IC1.12 57.13,13.32 57.15,13.34 | IC1.14 57.1,12.02 57.15,12.06 | IC1.10 55.5,15.24 | 55.5,15.24 55.82,14.92 57.15,14.92 | IC1.9 55.5,15.24 | IC1.4 61.34,14.61 IC1.5 | 57.15,20.32 57.15,14.92
  Bottom 0.406: JK2.SLEEVE R6.2 78.61,28.38 78.61,28.7 77.47,29.84 77.47,30.48 R4.1 | JK2.SLEEVE JK1.SLEEVE | JK2.SLEEVE JK3.SLEEVE R9.2 78.74,42.23 78.74,42.55 77.16,44.13 R7.1 | JK1.SLEEVE R3.2 78.74,14.29 78.74,14.61 77.16,16.19 R1.1 | JK1.SLEEVE 86.36,11.43 77.47,2.54 59.05,2.54 v57.15,4.45 | IC7.33 43.18,40.71 v43.18,43.18 | 48.79,41.38 IC7.35 45.72,38.31 45.72,36.83 48.26,34.29 50.75,34.29 IC7.43 53.29,36.83 54.61,36.83 v63.5,27.94 | 48.79,41.38 49.53,42.12 v49.53,43.18 | C8.2 48.79,41.38 | 50.8,20.32 v55.88,20.32 | C7.2 52.27,27.09 IC7.5 52.96,26.4 52.96,25.02 50.8,22.86 50.8,20.32 | 36.33,22.13 IC7.15 43.05,28.85 43.05,29.52 IC7.23 36.83,35.74 36.83,36.83 35.56,38.1 25.4,38.1 24.13,36.83 24.13,30.48 25.4,29.21 | 31.11,29.21 C10.2 31.11,27.62 | 31.11,29.21 C9.2 31.11,30.8 30.8,30.8 | 36.33,22.13 34.89,22.13 33.66,23.37 32.62,23.37 IC6.10 | IC5.8 21.91,11.43 21.91,9.53 | JP4.6 50.8,20.32 | 50.8,20.32 50.8,16.89 48.26,14.35 39.37,14.35 36.33,17.39 36.33,22.13 | JP2.2 v19.05,5.08 21.91,7.94 21.91,9.53 | 31.11,29.21 25.4,29.21 | 25.4,29.21 23.5,27.3 13.97,27.3 12.7,28.57 v12.7,29.21 12.7,31.75 11.43,33.02 v5.08,33.02 X1.2 | JP3.3 47.88,49.53 v49.53,47.88 | C3.2 21.65,9.78 21.91,9.53
  pour Bottom (isolate 0.61, rank 6): -1.27,57.15 90.81,57.15 90.81,-1.27 -1.27,-1.27
  pour Top (isolate 0.61, rank 6): -1.27,-1.27 -1.27,57.15 90.81,57.15 90.81,-1.27
MISO
  Bottom 0.406: JP4.1 43.81,19.05 43.81,22.73 46.74,25.65 46.74,25.78 46.36,26.16 IC7.11
MOSI
  Bottom 0.406: JP4.4 45.09,22.1 47.88,24.89 47.88,25.83 IC7.10
N$1
  Bottom 0.406: X1.1 9.92,37.03 D7.A
N$2
  Top 0.406: PWR.A 6.25,27.52 R14.1
N$3
  Bottom 0.406: IC5.6 29.21,13.97 31.24,11.94 31.24,10.79 32.59,9.45 IC6.3
N$4
  Bottom 0.406: IC6.5 32.32,13.4 29.21,16.51 IC5.4
N$5
  Top 0.406: PWR3.A 77.37,15.02 R13.1
N$6
  Top 0.406: R17.1 3.81,22.54 RSSI.A
N$7
  Bottom 0.406: IC6.9 31.56,21.4 29.21,19.05 IC5.2
N$8
  Bottom 0.406: IC6.16 12,13.4 12.7,12.7 IC5.10
N$9
  Top 0.406: PWR3.C 74.71,12.7 72.39,12.7 70.23,14.86 70.23,46.99 68.96,48.26 62.1,48.26 60.96,47.12 60.96,41.91 59.69,40.64 IC2.6
N$10
  Top 0.406: IC2.4 57.15,43.18 58.42,44.45 58.42,49.02 59.94,50.55 73.91,50.55 75.56,48.9 PWR1.C
N$11
  Top 0.406: IC2.18 62.55,34.29 62.23,34.29 60.96,33.02 60.96,29.53 R10.1
N$12
  Bottom 0.406: Q1.3 74.93,11.43 74.93,17.61 Q2.3 74.93,17.78 76.2,19.05 81.28,19.05 JK1.TIP
N$13
  Bottom 0.406: 72.39,12.38 Q1.2 71.61,13.33 D1.C
N$14
  Bottom 0.406: D2.C 71.61,19.68 Q2.2
N$15
  Bottom 0.406: 74.3,31.75 Q4.3 | Q3.3 Q4.3 | Q4.3 74.93,31.75 76.2,33.02 81.28,33.02 JK2.TIP
N$16
  Bottom 0.406: D3.C 71.61,27.3 Q3.2
N$17
  Bottom 0.406: D4.C 71.61,33.65 Q4.2
N$18
  Bottom 0.406: Q5.3 74.93,39.37 74.93,45.55 Q6.3 74.93,45.72 76.2,46.99 81.28,46.99 JK3.TIP
N$19
  Bottom 0.406: 72.39,40.32 Q5.2 71.61,41.27 D5.C
N$20
  Bottom 0.406: D6.C 71.61,47.62 Q6.2
N$22
  Top 0.406: R12.1 75.03,26.99 PWR2.A
N$23
  Top 0.406: 75.15,40.86 PWR1.A 77.37,40.86 R11.1
N$24
  Bottom 0.406: IC7.6 50.04,28.19 50.04,25.76 C7.1
N$25
  Bottom 0.406: IC7.42 52.07,36.74 52.07,38.1 C8.1
N$26
  Bottom 0.406: IC7.17 37.34,25.4 34.54,25.4 33.02,26.92 33.02,31.75 31.75,33.02 31.39,33.02 C9.1 | C9.1 31.11,33.02 29.84,34.29 26.67,34.29 K1.2 26.67,33.97 | 31.11,32.7 C9.1
N$27
  Bottom 0.406: 30.84,25.4 C10.1 | C10.1 31.39,25.4 33.02,25.4 34.29,24.13 37.2,24.13 IC7.16 | C10.1 30.8,25.4 30.48,25.4 29.21,24.13 26.92,24.13 K1.1
N$28
  Top 0.406: CN1.D+ 45.09,10.54 45.97,11.43 46.67,11.43 R20.2
N$29
  Top 0.406: CN1.D- 44.28,10.64 R21.2
N$30
  Bottom 0.406: R2.2 79.06,9.85 80.01,8.89 81.28,8.89 JK1.RING
N$32
  Bottom 0.406: R5.2 79.06,23.82 80.01,22.86 81.28,22.86 JK2.RING
N$33
  Top 0.406: PWR2.C 75.56,29.84 73.03,32.38 73.03,40.64 73.66,41.27 73.66,43.81 73.03,44.45 73.03,48.01 71.63,49.4 60.96,49.4 59.69,48.13 59.69,43.18 58.42,41.91 IC2.5
N$34
  Bottom 0.406: R8.2 79.06,37.78 80.01,36.83 81.28,36.83 JK3.RING
N$36
  Top 0.406: TX.A 6.25,11.21 R15.1
N$37
  Top 0.406: RX.A 6.25,14.19 R16.1
RESET  (via drill 0.7 pad 1.68)
  Top 0.406: v22.86,29.21 22.86,26.67 25.4,24.13 25.4,20.32 27.3,18.41 27.3,16.51 26.04,15.24 v25.4,15.24
  Bottom 0.406: IC7.25 35.47,39.37 24.13,39.37 22.86,38.1 v22.86,29.21 | IC5.5 v25.4,15.24
RSSI  (via drill 0.7 pad 1.68)
  Top 0.406: 6.35,20.32 R17.2 6.67,20.32 7.24,20.32 7.87,20.95 7.87,23.62 v6.35,25.15 | v29.21,17.78 29.21,16.26 25.65,12.7 24.13,12.7 22.86,13.97 22.86,19.05 20.32,21.59 v20.32,21.97
  Bottom 0.406: IC6.6 32.23,15.4 29.84,17.78 v29.21,17.78 | v6.35,25.15 6.73,24.77 17.53,24.77 v20.32,21.97
RST
  Bottom 0.406: JP4.5 45.72,15.88 41.27,15.88 40.01,17.14 R18.1 40.01,18.16 38.99,18.16 38.1,19.05 38.1,22.61 41.4,25.91 42.37,25.91 IC7.13
RTS  (via drill 0.7 pad 1.68)
  Top 0.406: v15.24,29.21 15.24,20.95 19.05,17.14 v19.05,7.62
  Bottom 0.406: 16.19,11.43 IC5.9 15.88,11.33 15.88,9.53 17.78,7.62 v19.05,7.62 | v15.24,29.21 15.24,41.91 16.51,43.18 35.05,43.18 IC7.28
RX  (via drill 0.7 pad 1.68)
  Top 0.406: v35.94,10.54 35.94,28.32 v36.83,29.21 | v3.81,18.41 RX.C
  Bottom 0.406: IC7.20 37.75,29.21 v36.83,29.21 | 32.8,7.4 IC6.2 | IC6.2 30.27,5.08 JP1.1 26.67,2.54 10.16,2.54 8.89,3.81 8.89,6.35 7.62,7.62 5.08,7.62 3.81,8.89 v3.81,18.41 | v35.94,10.54 32.77,7.37 | 32.77,7.37 32.64,7.37 | 32.77,7.37 32.73,7.4 IC6.2
SCK
  Bottom 0.406: IC7.9 48.9,25.94 48.9,24.13 46.35,21.59 46.35,19.05 JP4.3
SCL  (via drill 0.7 pad 1.68)
  Top 0.406: v34.29,36.83 48.26,36.83 52.07,33.02 IC2.12 54.86,33.02 55.5,33.66 57.78,33.66 58.42,33.02 58.42,31.75 55.88,29.08 55.88,22.73 53.59,20.45 53.59,17.78 53.59,17.65 53.59,17.14 54.82,15.92 IC1.8
  Bottom 0.406: IC7.18 37.48,26.67 35.31,26.67 34.29,27.69 34.29,32.26 33.02,33.53 33.02,35.56 v34.29,36.83
SDA  (via drill 0.7 pad 1.68)
  Top 0.406: v56.13,31.75 IC2.13 50.8,31.75 47.62,34.92 34.92,34.92 v34.29,34.29 | IC1.7 61.64,15.92 62.23,16.51 62.23,20.32 61.34,21.21 v60.96,21.59
  Bottom 0.406: v56.13,31.75 57.15,31.75 60.96,27.94 v60.96,21.59 | IC7.19 37.23,27.69 36.07,27.69 35.31,28.45 35.31,33.27 v34.29,34.29
SN1  (via drill 0.7 pad 1.68)
  Top 0.406: v83.82,20.95 83.82,31.75 85.72,33.66 85.72,36.2 84.45,37.47 84.45,48.26 78.74,53.98 52.7,53.98 52.07,53.34 52.07,47.62 52.7,46.99 IC2.1 53.66,46.99
  Bottom 0.406: R1.2 81.32,16.51 JK1.TSH 81.4,16.51 82.55,16.51 83.82,17.78 v83.82,20.95
SN2  (via drill 0.7 pad 1.68)
  Top 0.406: v83.82,34.92 83.19,35.56 83.19,47.62 77.98,52.83 57.15,52.83 55.88,51.56 55.88,46.35 55.24,45.72 IC2.2
  Bottom 0.406: R4.2 81.32,30.48 JK2.TSH 81.4,30.48 82.55,30.48 83.82,31.75 v83.82,34.92
SN3  (via drill 0.7 pad 1.68)
  Top 0.406: v77.47,49.53 75.31,51.69 58.42,51.69 57.15,50.42 57.15,45.72 55.88,44.45 IC2.3
  Bottom 0.406: R7.2 81.32,44.45 JK3.TSH 81.4,44.45 82.55,44.45 83.19,45.09 83.19,48.26 82.55,48.9 78.11,48.9 v77.47,49.53
TX  (via drill 0.7 pad 1.68)
  Top 0.406: v36.77,33.15 34.29,30.67 34.29,27.94 30.48,24.13 30.48,15.24 v25.4,10.16 22.86,7.62 22.86,3.81 21.59,2.54 10.16,2.54 8.89,3.81 8.89,6.35 7.62,7.62 5.08,7.62 3.81,8.89 TX.C
  Bottom 0.406: IC7.21 37.89,30.48 37.21,30.48 36.58,31.11 36.58,32.96 v36.77,33.15 | IC5.7 22.23,12.7 26.67,12.7 JP1.3 28.89,10.16 v25.4,10.16
VBUS  (via drill 0.7 pad 1.68)
  Top 0.406: CN1.VBUS 43.5,8.57 43.5,9.84 43.18,10.16 40.01,10.16 39.05,11.11 39.05,14.29 40.01,15.24 48.01,15.24 49.66,16.89 49.66,27.81 v46.99,30.48
  Bottom 0.406: IC7.7 46.99,30.11 v46.99,30.48

### Text on the board
tNames: 5V | 3V3 | I/O EXPANDER | + | S | + | - | 3 | - | 2 | ADC | 1 | DEMETER | DEMETER